# EAGLE schematic v0.9 (EAGLE 6.2)
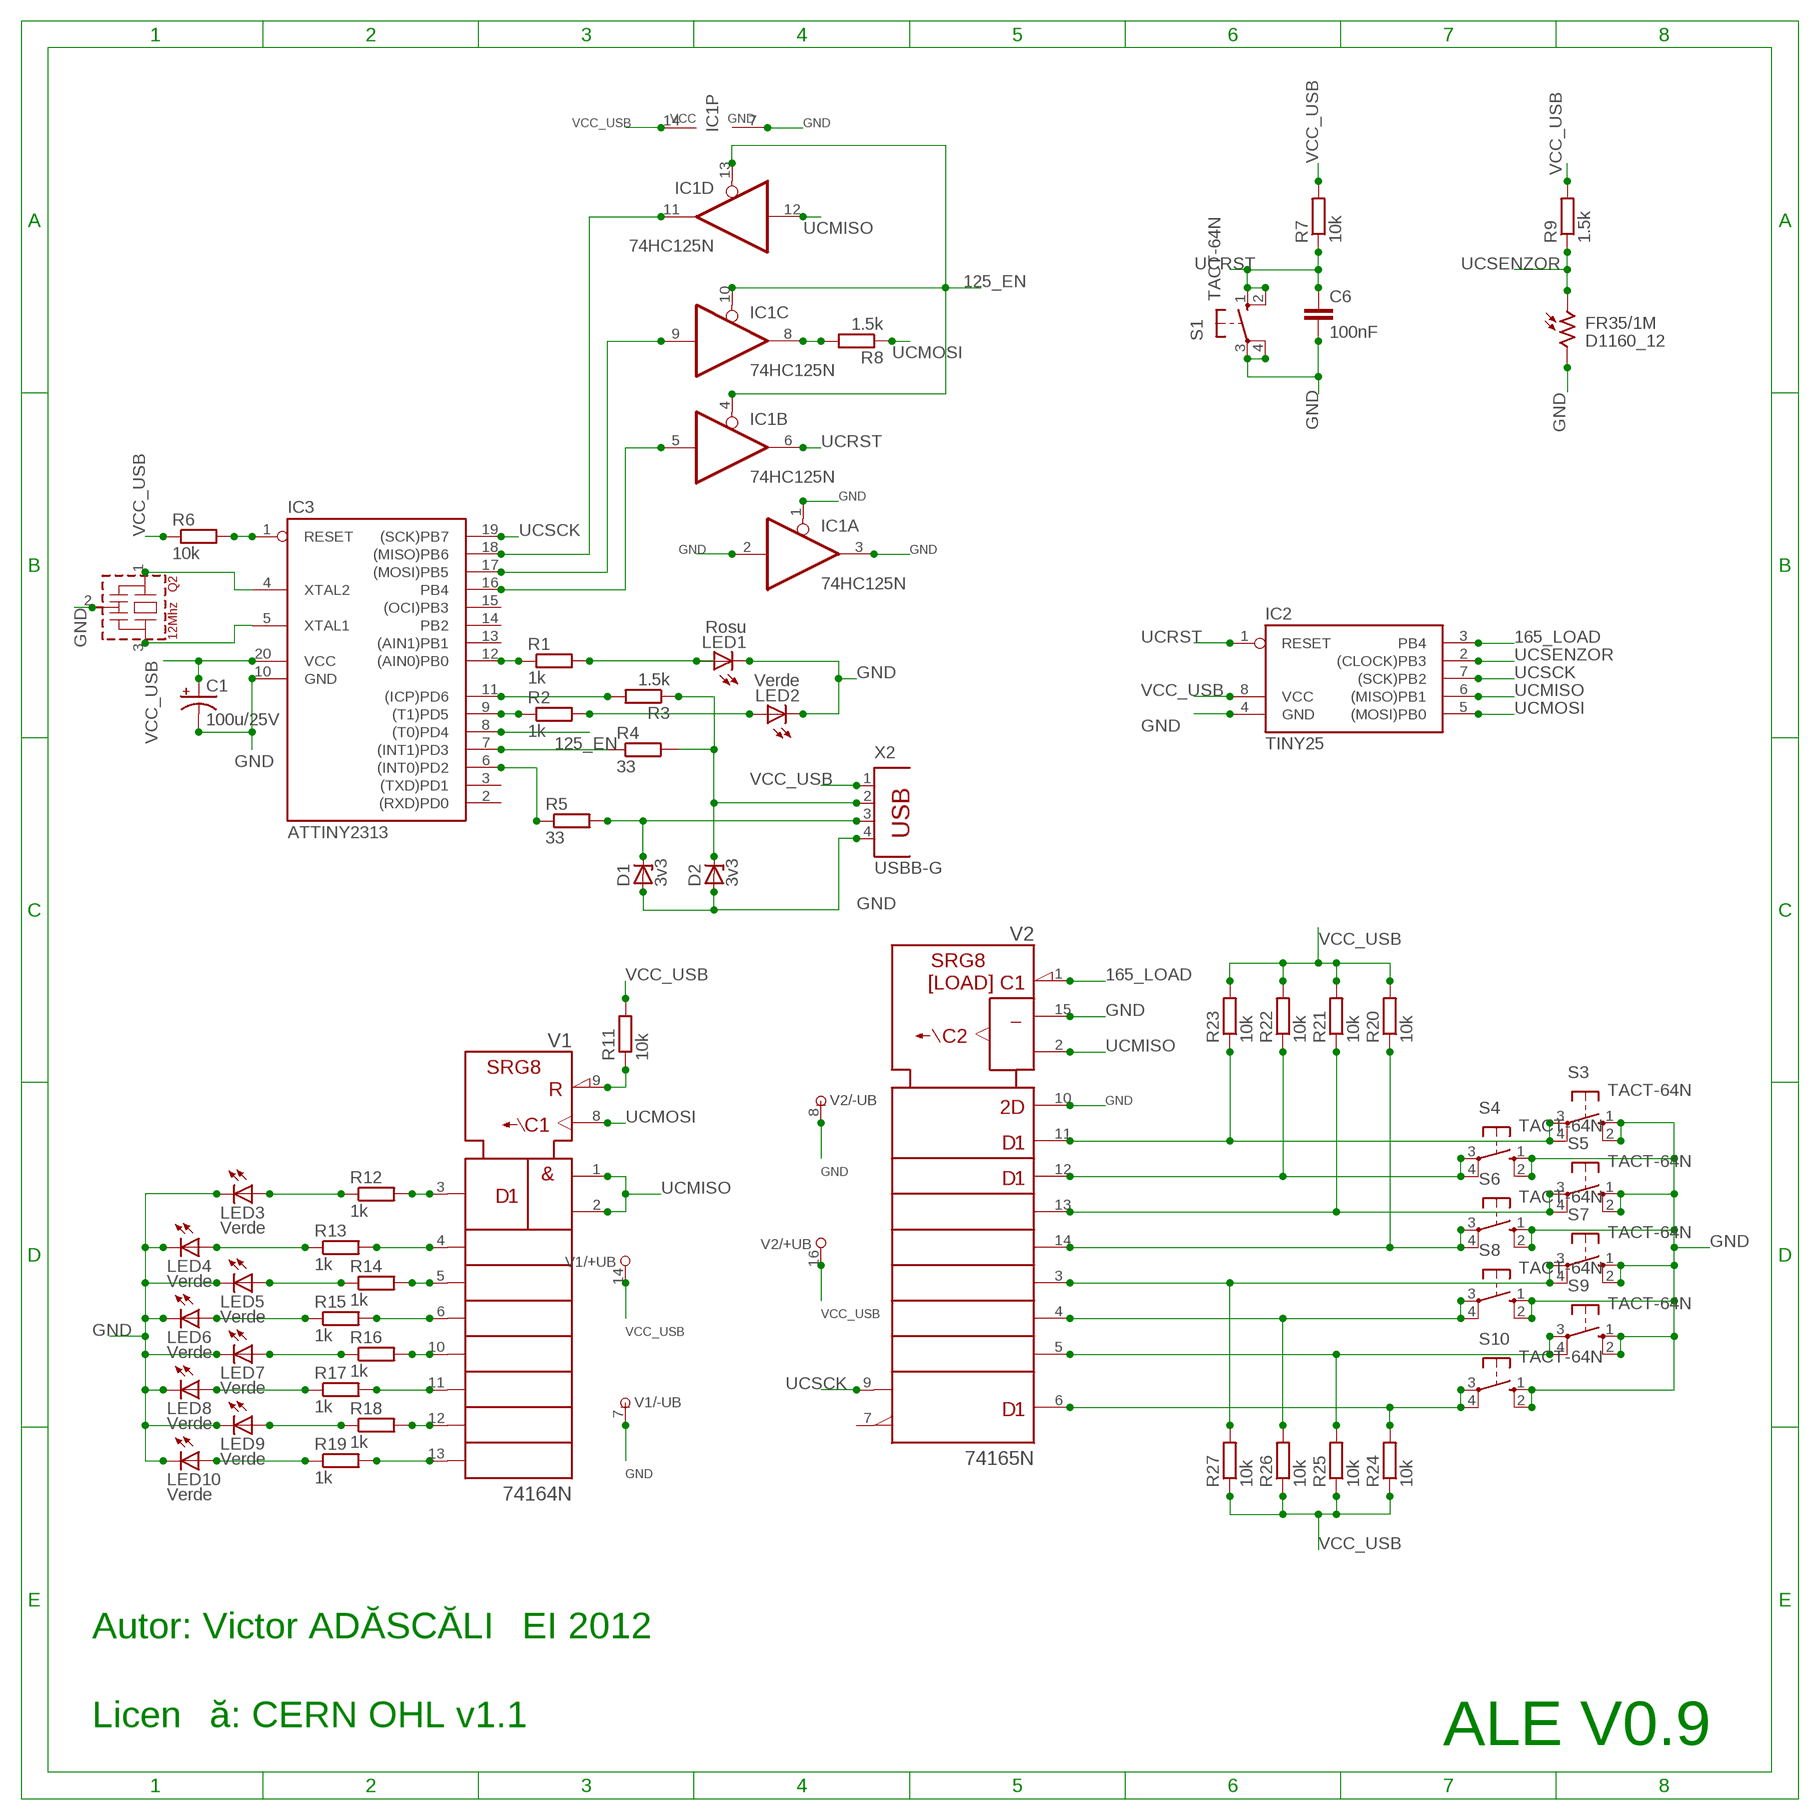
[diagram p0: schematic, sheet 1]

## Parts
C1  100u/25V  CPOL-USE2.5-6  [E2,5-6]
C6  100nF  C-EU050-025X075  [C050-025X075]
D1  3v3  ZENER-DIODEZD-7.5  [ZDIO-7.5]
D2  3v3  ZENER-DIODEZD-7.5  [ZDIO-7.5]
FR35/1M  D1160_12  [D11XX]
IC1  74HC125N  74AC125N  [DIL14]
IC2  TINY25  TINY22P  [DIL08]
IC3  ATTINY2313  AT90S2313P  [DIL20]
LED1  Rosu  LED3MM  [LED3MM]
LED2  Verde  LED3MM  [LED3MM]
LED3  Verde  LED3MM  [LED3MM]
LED4  Verde  LED3MM  [LED3MM]
LED5  Verde  LED3MM  [LED3MM]
LED6  Verde  LED3MM  [LED3MM]
LED7  Verde  LED3MM  [LED3MM]
LED8  Verde  LED3MM  [LED3MM]
LED9  Verde  LED3MM  [LED3MM]
LED10  Verde  LED3MM  [LED3MM]
Q2  12Mhz  CSTLS_X  [CSTLS_X]
R1  1k  R-EU_0207/10  [0207/10]
R2  1k  R-EU_0204/5  [0204/5]
R3  1.5k  R-EU_0207/10  [0207/10]
R4  33  R-EU_0207/12  [0207/12]
R5  33  R-EU_0207/10  [0207/10]
R6  10k  R-EU_0207/10  [0207/10]
R7  10k  R-EU_0207/10  [0207/10]
R8  1.5k  R-EU_0207/10  [0207/10]
R9  1.5k  R-EU_0207/12  [0207/12]
R11  10k  R-EU_0207/15  [0207/15]
R12  1k  R-EU_0207/10  [0207/10]
R13  1k  R-EU_0207/10  [0207/10]
R14  1k  R-EU_0207/10  [0207/10]
R15  1k  R-EU_0207/10  [0207/10]
R16  1k  R-EU_0207/10  [0207/10]
R17  1k  R-EU_0207/10  [0207/10]
R18  1k  R-EU_0207/10  [0207/10]
R19  1k  R-EU_0207/10  [0207/10]
R20  10k  R-EU_0207/10  [0207/10]
R21  10k  R-EU_0207/10  [0207/10]
R22  10k  R-EU_0207/10  [0207/10]
R23  10k  R-EU_0207/10  [0207/10]
R24  10k  R-EU_0207/10  [0207/10]
R25  10k  R-EU_0207/10  [0207/10]
R26  10k  R-EU_0207/10  [0207/10]
R27  10k  R-EU_0207/10  [0207/10]
S1  TACT-64N  10-XX  [B3F-10XX]
S3  TACT-64N  10-XX  [B3F-10XX]
S4  TACT-64N  10-XX  [B3F-10XX]
S5  TACT-64N  10-XX  [B3F-10XX]
S6  TACT-64N  10-XX  [B3F-10XX]
S7  TACT-64N  10-XX  [B3F-10XX]
S8  TACT-64N  10-XX  [B3F-10XX]
S9  TACT-64N  10-XX  [B3F-10XX]
S10  TACT-64N  10-XX  [B3F-10XX]
V1  74164N  [DIL14]
V2  74165N  [DIL16]
X2  USBB-G  PN61729  [PN61729]

## Nets
125_EN: IC1.4(B:OE) IC1.10(C:OE) IC1.13(D:OE) IC3.8((T0)PD4)
165_LOAD: IC2.3(PB4) V2.1(SH/!LD)
GND: C1.- C6.2 D1.A D2.A FR35/1M.2 IC1.1(A:OE) IC1.2(A:I) IC1.3(A:O) IC1.7(P:GND) IC2.4(GND) IC3.10(GND) LED1.K(C) LED2.K(C) LED3.K(C) LED4.K(C) LED5.K(C) LED6.K(C) LED7.K(C) LED8.K(C) LED9.K(C) LED10.K(C) Q2.2(VSS) S1.3(P) S1.4(P1) S3.1(S) S3.2(S1) S4.1(S) S4.2(S1) S5.1(S) S5.2(S1) S6.1(S) S6.2(S1) S7.1(S) S7.2(S1) S8.1(S) S8.2(S1) S9.1(S) S9.2(S1) S10.1(S) S10.2(S1) V1.7(-UB) V2.8(-UB) V2.10(SER) V2.15(CLK_INH) X2.4
N$1: IC1.5(B:I) IC3.16(PB4)
N$2: IC1.9(C:I) IC3.17((MOSI)PB5)
N$4: IC1.8(C:O) R8.2
N$5: IC1.11(D:O) IC3.18((MISO)PB6)
N$6: R11.1 V1.9(!CLR)
N$7: IC3.1(RESET) R6.2
N$8: IC3.7((INT1)PD3) R4.1
N$9: LED2.A R2.2
N$10: IC3.9((T1)PD5) R2.1
N$11: R23.1 S3.3(P) S3.4(P1) V2.11(A)
N$12: LED3.A R12.1
N$13: IC3.12((AIN0)PB0) R1.1
N$14: LED1.A R1.2
N$15: IC3.6((INT0)PD2) R5.1
N$16: IC3.11((ICP)PD6) R3.2
N$17: D2.C R3.1 R4.2 X2.2
N$18: IC3.4(XTAL2) Q2.1
N$19: D1.C R5.2 X2.3
N$20: IC3.5(XTAL1) Q2.3
N$21: LED4.A R13.1
N$22: LED5.A R14.1
N$23: LED6.A R15.1
N$24: LED7.A R16.1
N$25: LED8.A R17.1
N$26: LED9.A R18.1
N$27: LED10.A R19.1
N$28: R12.2 V1.3(QA)
N$29: R13.2 V1.4(QB)
N$30: R14.2 V1.5(QC)
N$31: R15.2 V1.6(QD)
N$32: R16.2 V1.10(QE)
N$33: R17.2 V1.11(QF)
N$34: R18.2 V1.12(QG)
N$35: R19.2 V1.13(QH)
N$36: R22.1 S4.3(P) S4.4(P1) V2.12(B)
N$37: R21.1 S5.3(P) S5.4(P1) V2.13(C)
N$38: R20.1 S6.3(P) S6.4(P1) V2.14(D)
N$39: R27.2 S7.3(P) S7.4(P1) V2.3(E)
N$40: R26.2 S8.3(P) S8.4(P1) V2.4(F)
N$41: R25.2 S9.3(P) S9.4(P1) V2.5(G)
N$42: R24.2 S10.3(P) S10.4(P1) V2.6(H)
UCMISO: IC1.12(D:I) IC2.6((MISO)PB1) V1.1(A) V1.2(B) V2.2(CLK)
UCMOSI: IC2.5((MOSI)PB0) R8.1 V1.8(CLK)
UCRST: C6.1 IC1.6(B:O) IC2.1(RESET) R7.1 S1.1(S) S1.2(S1)
UCSCK: IC2.7((SCK)PB2) IC3.19((SCK)PB7) V2.9(QH)
UCSENZOR: FR35/1M.1 IC2.2((CLOCK)PB3) R9.1
VCC_USB: C1.+ IC1.14(P:VCC) IC2.8(VCC) IC3.20(VCC) R6.1 R7.2 R9.2 R11.2 R20.2 R21.2 R22.2 R23.2 R24.1 R25.1 R26.1 R27.1 V1.14(+UB) V2.16(+UB) X2.1
Unconnected: IC3.2((RXD)PD0) IC3.3((TXD)PD1) IC3.13((AIN1)PB1) IC3.14(PB2) IC3.15((OCI)PB3) V2.7(!QH)

## Notes on the sheet
- Autor: Victor ADĂSCĂLIȚEI 2012
- Licență: CERN OHL v1.1
- ALE V0.9

## Library data of the parts
C1 = rcl:CPOL-US: POLARIZED CAPACITOR, American symbol
C6 = rcl:C-EU: CAPACITOR, European symbol
D1 D2 = diode:ZENER-DIODE: Z-Diode
FR35/1M = photo-elements:D11: Photo Sensor Oil Burner Control Applications Source: http://optoelectronics.perkinelmer.com/content/Datasheets/DTS_PhotocellsD1160.pdf
IC1 = 74xx-eu:74*125: Quad bus BUFFER, 3-state
IC2 = atmel:TINY22: MICROCONTROLLER 1K ROM 128 bytes RAM 128 bytes EEPROM
IC3 = atmel:AT90S2313: MICROCONTROLLER 2 Kbytes FLASH 128 bytes SRAM 128 bytes EEPROM UART
LED1-LED10 = led:LED: LED OSRAM: - CHIPLED LG R971, LG N971, LY N971, LG Q971, LY Q971, LO R971, LY R971 LH N974, LH R974 LS Q976, LO Q976, LY Q976 LO Q996 - Hyper CHIPLED LW Q18S LB Q993, LB Q99A, LB R99A - SideLED LS A670, LO A670, LY A670, LG A670, LP A670 LB A673, LV A673, LT A673, LW A673 LH A674 LY A675 LS A676, LA A676, LO A676, LY A676, LW A676 LS A679, LY A679, LG A679 - Hyper Micro SIDELED® LS Y876, LA Y876, LO Y876, LY Y876 LT Y87S - SmartLED LW L88C, LW L88S LB L89C, LB L89S, LG L890 LS L89K, LO L89K, LY L89K LS L896, LA L896, LO L896, LY L896 - TOPLED LS T670, LO T670, LY T670, LG T670, LP T670 LSG T670, LSP T670, LSY T670, LOP T670, LYG T670 LG T671, LOG T671, LSG T671 LB T673, LV T673, LT T673, LW T673 LH T674 LS T676, LA T676, LO T676, LY T676, LB T676, LH T676, LSB T676, LW T676 LB T67C, LV T67C, LT T67C, LS T67K, LO T67K, LY T67K, LW E67C LS E67B, LA E67B, LO E67B, LY E67B, LB E67C, LV E67C, LT E67C LW T67C LS T679, LY T679, LG T679 LS T770, LO T770, LY T770, LG T770, LP T770 LB T773, LV T773, LT T773, LW T773 LH T774 LS E675, LA E675, LY E675, LS T675 LS T776, LA T776, LO T776, LY T776, LB T776 LHGB T686 LT T68C, LB T68C - Hyper Mini TOPLED® LB M676 - Mini TOPLED Santana® LG M470 LS M47K, LO M47K, LY M47K Source: http://www.osram.convergy.de LUXEON: - LUMILED® LXK2-PW12-R00, LXK2-PW12-S00, LXK2-PW14-U00, LXK2-PW14-V00 LXK2-PM12-R00, LXK2-PM12-S00, LXK2-PM14-U00 LXK2-PE12-Q00, LXK2-PE12-R00, LXK2-PE12-S00, LXK2-PE14-T00, LXK2-PE14-U00 LXK2-PB12-K00, LXK2-PB12-L00, LXK2-PB12-M00, LXK2-PB14-N00, LXK2-PB14-P00, LXK2-PB14-Q00 LXK2-PR12-L00, LXK2-PR12-M00, LXK2-PR14-Q00, LXK2-PR14-R00 LXK2-PD12-Q00, LXK2-PD12-R00, LXK2-PD12-S00 LXK2-PH12-R00, LXK2-PH12-S00 LXK2-PL12-P00, LXK2-PL12-Q00, LXK2-PL12-R00 Source: www.luxeon.com KINGBRIGHT: KA-3528ASYC Source: www.kingbright.com
Q2 = murata-resonators:CSTLS_X: Ceramic resonator 16.00 to 70.00 MHz
R1-R9 R11-R27 = rcl:R-EU_: RESISTOR, European symbol
S1 S3-S10 = switch-omron:10-XX: OMRON SWITCH
V1 = 74ttl-din:74*164: 8-bit parallel out SHIFT REGISTER
V2 = 74ttl-din:74*165: 8-bit parallel load SHIFT REGISTER
X2 = con-berg:PN61729: BERG USB connector